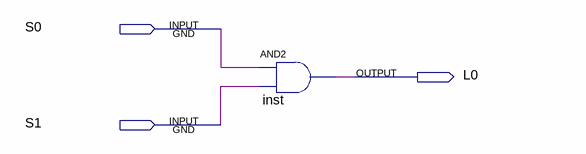
[diagram p0: schematic sheet]
// Quartus schematic andgate.bdf as structural Verilog: 1 symbols, 3 pins
module andgate (
  input  S0,
  input  S1,
  output L0
);

  and inst (L0, S0, S1);
endmodule
